# EAGLE schematic Slave (EAGLE 9.6.2)
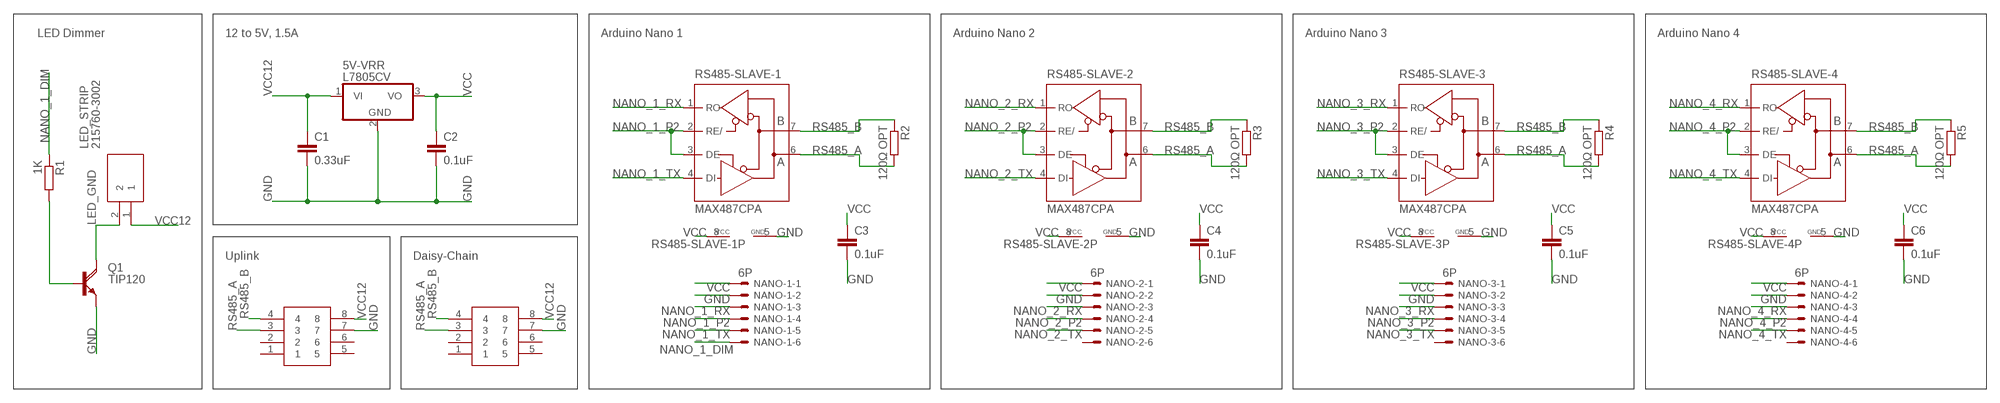
[diagram p0: schematic, sheet 1]

## Parts
5V-VRR  L7805CV  7805T  [TO220H]
C1  0.33uF  C-EU025-025X050  [C025-025X050]
C2  0.1uF  C-EU025-025X050  [C025-025X050]
C3  0.1uF  C-EU025-025X050  [C025-025X050]
C4  0.1uF  C-EU025-025X050  [C025-025X050]
C5  0.1uF  C-EU025-025X050  [C025-025X050]
C6  0.1uF  C-EU025-025X050  [C025-025X050]
LED_STRIP  215760-3002  [215760-YY02]
NANO-1  6P  22-23-2061  [22-23-2061]
NANO-2  6P  22-23-2061  [22-23-2061]
NANO-3  6P  22-23-2061  [22-23-2061]
NANO-4  6P  22-23-2061  [22-23-2061]
Q1  TIP120  [TO220AH]
R1  1K  R-EU_0207/10  [0207/10]
R2  120Ω OPT  R-EU_0207/10  [0207/10]
R3  120Ω OPT  R-EU_0207/10  [0207/10]
R4  120Ω OPT  R-EU_0207/10  [0207/10]
R5  120Ω OPT  R-EU_0207/10  [0207/10]
RS485-SLAVE-1  MAX487CPA  [DIL08]
RS485-SLAVE-2  MAX487CPA  [DIL08]
RS485-SLAVE-3  MAX487CPA  [DIL08]
RS485-SLAVE-4  MAX487CPA  [DIL08]
UPLINK  212528-0801  [212528-08YY]
UPLINK1  212528-0801  [212528-08YY]

## Nets
GND: 5V-VRR.2(GND) C1.2 C2.2 C3.2 C4.2 C5.2 C6.2 NANO-1.2 NANO-2.2 NANO-3.2 NANO-4.2 Q1.E RS485-SLAVE-1.5(GND) RS485-SLAVE-2.5(GND) RS485-SLAVE-3.5(GND) RS485-SLAVE-4.5(GND) UPLINK1.7 UPLINK.7
LED_GND: LED_STRIP.2 Q1.C
N$1: Q1.B R1.2
NANO_1_DIM: NANO-1.6 R1.1
NANO_1_P2: NANO-1.4 RS485-SLAVE-1.2(RE/) RS485-SLAVE-1.3(DE)
NANO_1_RX: NANO-1.3 RS485-SLAVE-1.1(RO)
NANO_1_TX: NANO-1.5 RS485-SLAVE-1.4(DI)
NANO_2_P2: NANO-2.4 RS485-SLAVE-2.2(RE/) RS485-SLAVE-2.3(DE)
NANO_2_RX: NANO-2.3 RS485-SLAVE-2.1(RO)
NANO_2_TX: NANO-2.5 RS485-SLAVE-2.4(DI)
NANO_3_P2: NANO-3.4 RS485-SLAVE-3.2(RE/) RS485-SLAVE-3.3(DE)
NANO_3_RX: NANO-3.3 RS485-SLAVE-3.1(RO)
NANO_3_TX: NANO-3.5 RS485-SLAVE-3.4(DI)
NANO_4_P2: NANO-4.4 RS485-SLAVE-4.2(RE/) RS485-SLAVE-4.3(DE)
NANO_4_RX: NANO-4.3 RS485-SLAVE-4.1(RO)
NANO_4_TX: NANO-4.5 RS485-SLAVE-4.4(DI)
RS485_A: R2.2 R3.2 R4.2 R5.2 RS485-SLAVE-1.6(A) RS485-SLAVE-2.6(A) RS485-SLAVE-3.6(A) RS485-SLAVE-4.6(A) UPLINK1.3 UPLINK.3
RS485_B: R2.1 R3.1 R4.1 R5.1 RS485-SLAVE-1.7(B) RS485-SLAVE-2.7(B) RS485-SLAVE-3.7(B) RS485-SLAVE-4.7(B) UPLINK1.4 UPLINK.4
VCC: 5V-VRR.3(VO) C2.1 C3.1 C4.1 C5.1 C6.1 NANO-1.1 NANO-2.1 NANO-3.1 NANO-4.1 RS485-SLAVE-1.8(VCC) RS485-SLAVE-2.8(VCC) RS485-SLAVE-3.8(VCC) RS485-SLAVE-4.8(VCC)
VCC12: 5V-VRR.1(VI) C1.1 LED_STRIP.1 UPLINK1.8 UPLINK.8
Unconnected: NANO-2.6 NANO-3.6 NANO-4.6 UPLINK1.1 UPLINK1.2 UPLINK1.5 UPLINK1.6 UPLINK.1 UPLINK.2 UPLINK.5 UPLINK.6

## Notes on the sheet
- LED Dimmer | 12 to 5V, 1.5A | Arduino Nano 1 | Arduino Nano 2 | Arduino Nano 3 | Arduino Nano 4
- Uplink | Daisy-Chain

## Library data of the parts
5V-VRR = linear:78*: Positive VOLTAGE REGULATOR Source: http://cache.national.com/ds/LM/LM78L05.pdf http://www.fairchildsemi.com/ds/LM/LM7805.pdf
C1-C6 = rcl:C-EU: CAPACITOR, European symbol; SPICEPREFIX: C
LED_STRIP = SamacSys_Parts:215760-3002: Micro-Fit+ Right-Angle Header, 3.00mm Pitch, Single Row, 2 Circuits, UL 94V-0, Glow-Wire Capable, Black Source: Datasheet <https://www.molex.com/pdm_docs/sd/2157601002_sd.pdf>; DESCRIPTION: Micro-Fit+ Right-Angle Header, 3.00mm Pitch, Single Row, 2 Circuits, UL 94V-0, Glow-Wire Capable, Black; HEIGHT: 5.87mm; MANUFACTURER_NAME: Molex; MANUFACTURER_PART_NUMBER: 215760-3002; MOUSER_PART_NUMBER: 538-215760-3002; MOUSER_PRICE-STOCK: https://www.mouser.co.uk/ProductDetail/Molex/215760-3002?qs=pBJMDPsKWf2Kd79WPESr9w%3D%3D
NANO-1-NANO-4 = con-molex:22-23-2061: .100" (2.54mm) Center Header - 6 Pin; MF: MOLEX; MPN: 22-23-2061; OC_FARNELL: 1462922; OC_NEWARK: 27C1933
Q1 = transistor-power:TIP120: NPN DARLINGTON TRANSISTOR
R1-R5 = rcl:R-EU_: RESISTOR, European symbol; SPICEPREFIX: R
RS485-SLAVE-1-RS485-SLAVE-4 = A10 Library:MAX487CPA: RS485 TRANSEIVER; MPN: MAX487CPA; OC_FARNELL: unknown; OC_NEWARK: unknown
UPLINK UPLINK1 = SamacSys_Parts:212528-0801: Micro-Fit+ Right-Angle Header, 3.00mm Pitch, Dual Row, 8 Circuits, UL 94V-0, Glow-Wire Capable, Black Source: Datasheet <https://www.molex.com/pdm_docs/sd/2125280200_sd.pdf>; DESCRIPTION: Micro-Fit+ Right-Angle Header, 3.00mm Pitch, Dual Row, 8 Circuits, UL 94V-0, Glow-Wire Capable, Black; HEIGHT: 14mm; MANUFACTURER_NAME: Molex; MANUFACTURER_PART_NUMBER: 212528-0801; MOUSER_PART_NUMBER: 538-212528-0801; MOUSER_PRICE-STOCK: https://www.mouser.co.uk/ProductDetail/Molex/212528-0801?qs=W%2FMpXkg%252BdQ6GImXrcV4pVA%3D%3D

## Net classes
0 default: width 0.406 mm, drill 0.254 mm, clearance 0.406 mm